# Altium schematic sheet MagnetSensor.SchDoc
size A4
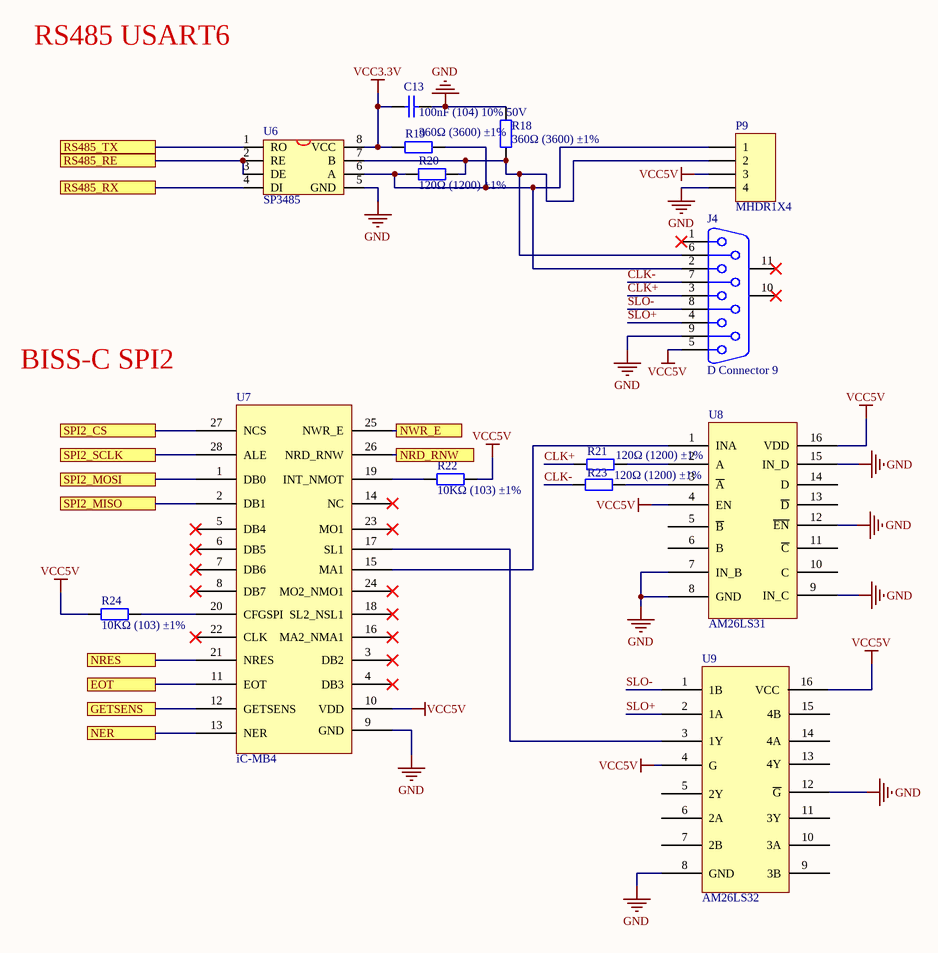
[diagram p0: MagnetSensor.SchDoc]

## Parts
C13  100nF (104) 10% 50V  [0402_C]
J4  D Connector 9  [DSUB1.385-2H9]
P9  MHDR1X4  [SH1.0-4P-L]
R18  360Ω (3600) ±1%  [0402_R]
R19  360Ω (3600) ±1%  [0402_R]
R20  120Ω (1200) ±1%  [0402_R]
R21  120Ω (1200) ±1%  [0402_R]
R22  10KΩ (103) ±1%  [0402_R]
R23  120Ω (1200) ±1%  [0402_R]
R24  10KΩ (103) ±1%  [0402_R]
U6  SP3485  [SOP-8]
U7  iC-MB4  [QFN-28_5x5x05P]
U8  AM26LS31  [SO-16_N]
U9  AM26LS32  [SO-16_N]

## Ports
EOT, GETSENS, NER, NRD_RNW, NRES, NWR_E, RS485_RE, RS485_RX, RS485_TX, SPI2_CS, SPI2_MISO, SPI2_MOSI, SPI2_SCLK

## Nets
GND: C13.1 J4.9 P9.4 R18.2 U6.5(GND) U7.9(GND) U8.7(IN_B) U8.8(GND) U8.9(IN_C) U8.12(~{EN}) U8.15(IN_D) U9.8(GND) U9.12(~{G})
VCC3.3V: C13.2 R19.1 U6.8(VCC)
VCC5V: J4.5 P9.3 R22.1 R24.2 U7.10(VDD) U8.4(EN) U8.16(VDD) U9.4(G) U9.16(VCC)
CLK+: J4.3 R21.2
CLK-: J4.7 R23.2
EOT: U7.11(EOT) ; port EOT
GETSENS: U7.12(GETSENS) ; port GETSENS
NER: U7.13(NER) ; port NER
NRD_RNW: U7.26(NRD_RNW) ; port NRD_RNW
NRES: U7.21(NRES) ; port NRES
NWR_E: U7.25(NWR_E) ; port NWR_E
RS485_RE: U6.2(RE) U6.3(DE) ; port RS485_RE
RS485_RX: U6.4(DI) ; port RS485_RX
RS485_TX: U6.1(RO) ; port RS485_TX
SLO+: J4.4 U9.2(1A)
SLO-: J4.8 U9.1(1B)
SPI2_CS: U7.27(NCS) ; port SPI2_CS
SPI2_MISO: U7.2(DB1) ; port SPI2_MISO
SPI2_MOSI: U7.1(DB0) ; port SPI2_MOSI
SPI2_SCLK: U7.28(ALE) ; port SPI2_SCLK
NetJ4_2: J4.2 P9.1 R19.2 R20.2 U6.6(A)
NetJ4_6: J4.6 P9.2 R18.1 R20.1 U6.7(B)
NetR21_1: R21.1 U8.2(A)
NetR22_2: R22.2 U7.19(INT_NMOT)
NetR23_1: R23.1 U8.3(~{A})
NetR24_1: R24.1 U7.20(CFGSPI)
NetU7_15: U7.15(MA1) U8.1(INA)
NetU7_17: U7.17(SL1) U9.3(1Y)

Not connected (* = marked no-connect by the designer): J4 1* 10(MH1)* 11(MH2)*; U7 3(DB2)* 4(DB3)* 5(DB4)* 6(DB5)* 7(DB6)* 8(DB7)* 14(NC)* 16(MA2_NMA1)* 18(SL2_NSL1)* 22(CLK)* 23(MO1)* 24(MO2_NMO1)*; U8 5(~{B}) 6(B) 10(C) 11(~{C}) 13(~{D}) 14(D); U9 5(2Y) 6(2A) 7(2B) 9(3B) 10(3A) 11(3Y) 13(4Y) 14(4A) 15(4B)

## Notes on the sheet
- RS485 USART6
- BISS-C SPI2

## Library data of the parts
C13 = 0603 100nF (104) 10% 50V: 贴片电容; ComponentLink1Description: 供应商链接; ComponentLink1URL: http://www.szlcsc.com/product/details_15331.html; Package: 0603; Supplier: LC; SuppliersPartNumber: C14663
J4 = D Connector 9: Receptacle Assembly, 9 Position, Right Angle; PackageDocument: O; Positions: 9; Published: 15-Jun-2001; LatestRevisionDate: 17-Jul-2002; LatestRevisionNote: Re-released for DXP Platform.; DatasheetDocument: 1-Sep-1999; PackageReference: 788750; Publisher: Altium Limited; Orientation: Right Angle; Gender: Receptacle
P9 = MHDR1X4: Header, 4-Pin; LatestRevisionDate: 17-Jul-2002; LatestRevisionNote: Re-released for DXP Platform.; Publisher: Altium Limited
R18 R19 R21-R24 = 0603 360Ω (3600) 1%: 贴片电阻; ComponentLink1Description: 供应商链接; ComponentLink1URL: http://www.szlcsc.com/product/details_25937.html; Package: 0603; Supplier: LC; SuppliersPartNumber: C25194
R20 = 0603 120Ω (1200) 1%: 贴片电阻; ComponentLink1Description: 供应商链接; ComponentLink1URL: http://www.szlcsc.com/product/details_23514.html; Package: 0603; Supplier: LC; SuppliersPartNumber: C22787
U6 = MAX3485
U7 = iC-MB4: SPI转BiSS主站芯片
U8 = AM26LS31: AM32LS31 单端转差分芯片
U9 = AM26LS32: AM26LS32 差分转单端